# Altium project sig_gen_card.PrjPcb (part 3 of 4)
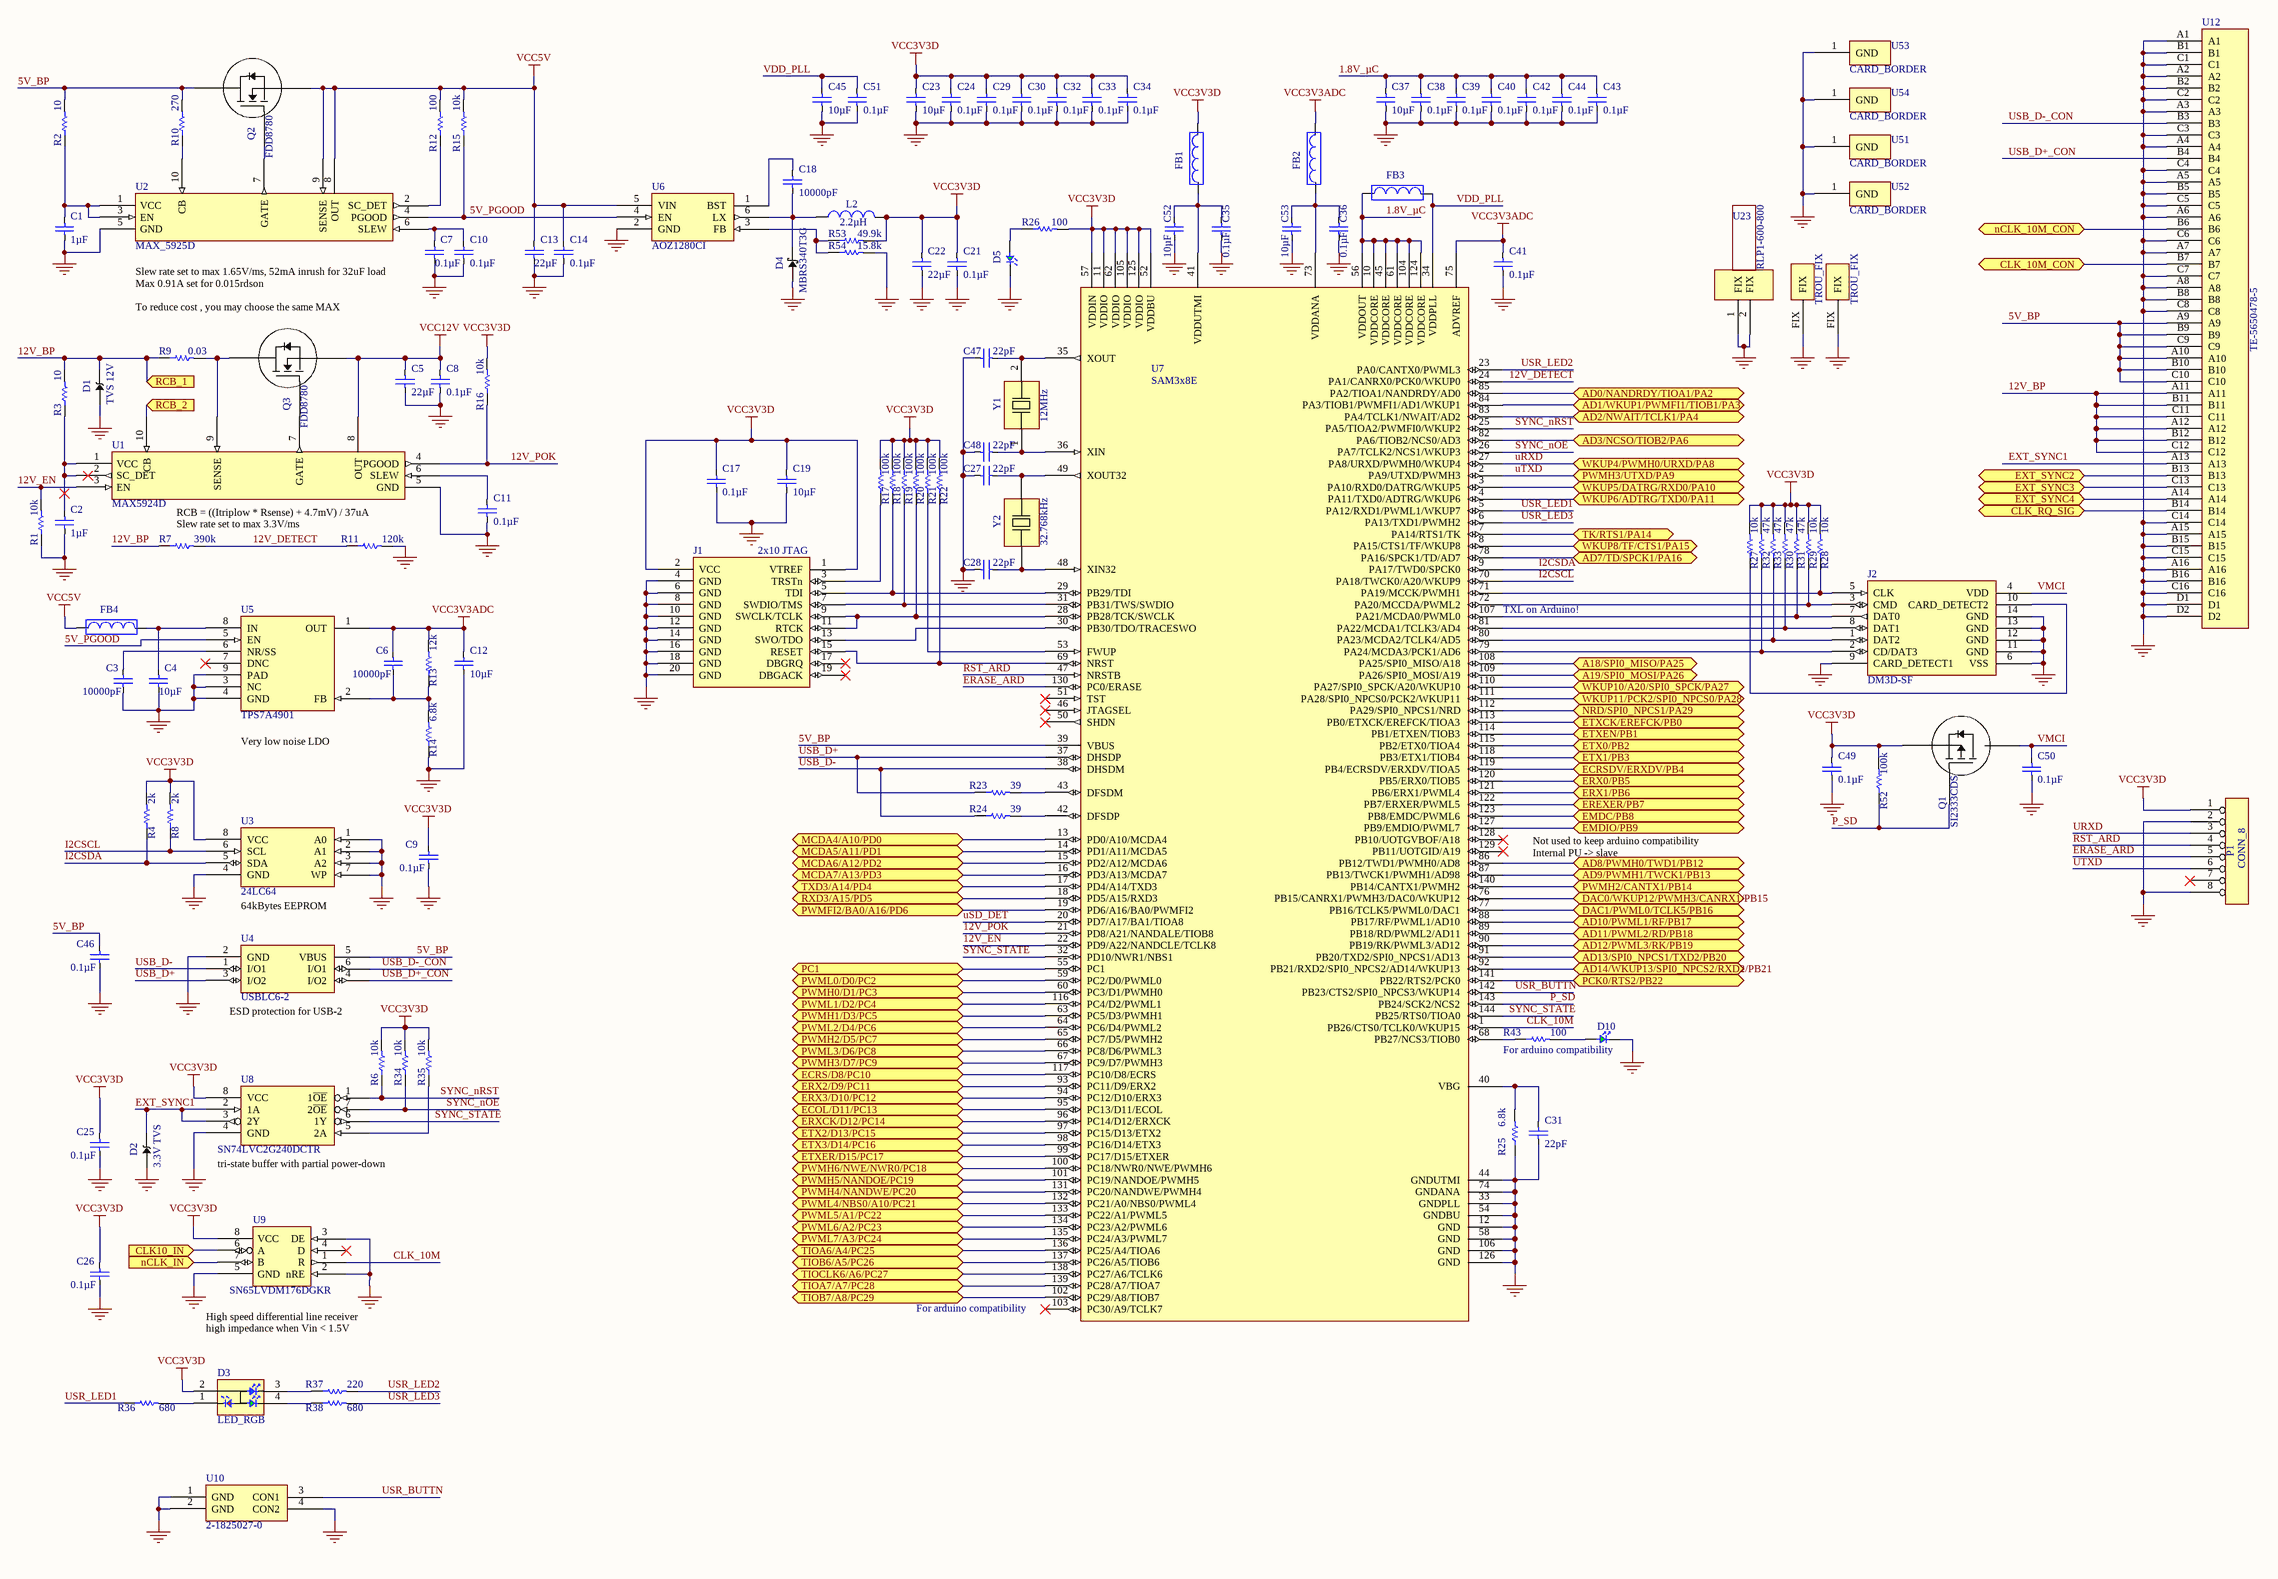
[diagram p6: EasyPHI_Core.SchDoc]

## Sheet EasyPHI_Core.SchDoc (continued)
### Library data of the parts
C1 C2 = EMK107B7105KA-T: CAP CER 1UF 16V X7R 0603; Manufacturer: Taiyo Yuden; Tolerance: ±10%; Design Item Id: EMK107B7105KA-T; Supplier 1: Digi-Key; Supplier Part Number 1: 587-1241-1-ND; Manufacturer Part Number: EMK107B7105KA-T; RoHS: RoHS Compliant; Category: Capacitors; Stock 1: 3073749; Pricing 1: 1=0.1, 10=0.06, 50=0.0326, 100=0.0275, 250=0.02252, 500=0.01926, 1000=0.015 (USD); Packaging: Cut Tape (CT); Applications: General Purpose; Operating Temperature: -55°C ~ 125°C; Mounting Type: Surface Mount, MLCC; Package / Case: 0603 (1608 Metric); ComponentLink1URL: http://ds.yuden.co.jp/TYCOMPAS/ut/detail.do?productNo=EMK107B7105KA-T&fileName=EMK107B7105KA-T_SS&mode=specSheetDownload; ComponentLink1Description: http://ds.yuden.co.jp/TYCOMPAS/ut/detail.do?productNo=EMK107B7105KA-T&fileName=EMK107B7105KA-T_SS&mode=specSheetDownload; Capacitance: 1µF; Voltage - Rated: 16V; Temperature Coefficient: X7R; Ratings: -; Size / Dimension: 0.063" L x 0.031" W (1.60mm x 0.80mm); Height - Seated (Max): -; Thickness (Max): 0.035" (0.90mm); Lead Spacing: -; Features: -; Lead Style: -
C3 C6 C18 = C0603C103K5RACTU: CAP CER 10000PF 50V X7R 0603; Manufacturer: Kemet; Tolerance: ±10%; Design Item Id: C0603C103K5RACTU; Supplier 1: Digi-Key; Supplier Part Number 1: 399-1091-1-ND; Manufacturer Part Number: C0603C103K5RACTU; RoHS: RoHS Compliant; Category: Capacitors; Stock 1: 1598674; Pricing 1: 1=0.1, 10=0.019, 50=0.0104, 100=0.0088, 250=0.0072, 500=0.00616, 1000=0.0048 (USD); Packaging: Cut Tape (CT); Applications: General Purpose; Operating Temperature: -55°C ~ 125°C; Mounting Type: Surface Mount, MLCC; Package / Case: 0603 (1608 Metric); ComponentLink1URL: http://www.kemet.com/docfinder?Partnumber=C0603C103K5RACTU; ComponentLink1Description: http://www.kemet.com/docfinder?Partnumber=C0603C103K5RACTU; Capacitance: 10000pF; Voltage - Rated: 50V; Temperature Coefficient: X7R; Ratings: -; Size / Dimension: 0.063" L x 0.031" W (1.60mm x 0.80mm); Height - Seated (Max): -; Thickness (Max): 0.034" (0.87mm); Lead Spacing: -; Features: -; Lead Style: -
C4 C12 C19 C23 C37 C45 C52 C53 = GRM188R60J106ME47J: CAP CER 10UF 6.3V 20% X5R 0603; Manufacturer: Murata Electronics North America; Design Item Id: GRM188R60J106ME47J; Supplier 1: Digi-Key; Supplier Part Number 1: 490-6405-1-ND; Manufacturer Part Number: GRM188R60J106ME47J; RoHS: RoHS Compliant; Category: Capacitors; Stock 1: 28946; Pricing 1: 1=0.19, 10=0.128, 50=0.0776, 100=0.0651, 250=0.05272, 500=0.0465, 1000=0.03953, 5000=0.03333 (USD); Packaging: Cut Tape (CT); Applications: General Purpose; Operating Temperature: -55°C ~ 85°C; Mounting Type: Surface Mount, MLCC; Package / Case: 0603 (1608 Metric); ComponentLink1URL: http://search.murata.co.jp/Ceramy/image/img/A01X/G101/ENG/GRM188R60J106ME47-01.pdf; ComponentLink1Description: http://search.murata.co.jp/Ceramy/image/img/A01X/G101/ENG/GRM188R60J106ME47-01.pdf; Capacitance: 10µF; Tolerance: ±20%; Voltage - Rated: 6.3V; Temperature Coefficient: X5R; Ratings: -; Size / Dimension: 0.063" L x 0.031" W (1.60mm x 0.80mm); Height - Seated (Max): -; Thickness (Max): 0.035" (0.90mm); Lead Spacing: -; Features: -; Lead Style: -
C5 C13 C22 = C2012X5R1C226K125AC: CAP CER 22UF 16V X5R 0805; Manufacturer: TDK Corporation; Tolerance: ±10%; Design Item Id: C2012X5R1C226K125AC; Supplier 1: Digi-Key; Supplier Part Number 1: 445-6797-1-ND; Manufacturer Part Number: C2012X5R1C226K125AC; RoHS: RoHS Compliant; Category: Capacitors; Stock 1: 448776; Pricing 1: 1=0.77, 10=0.737, 100=0.3575, 250=0.297, 500=0.2695, 1000=0.2475 (USD); Packaging: Cut Tape (CT); Applications: General Purpose; Operating Temperature: -55°C ~ 85°C; Mounting Type: Surface Mount, MLCC; Package / Case: 0805 (2012 Metric); ComponentLink1URL: https://product.tdk.com/info/en/catalog/datasheets/mlcc_commercial_general_en.pdf; ComponentLink1Description: https://product.tdk.com/info/en/catalog/datasheets/mlcc_commercial_general_en.pdf; Capacitance: 22µF; Voltage - Rated: 16V; Temperature Coefficient: X5R; Ratings: -; Size / Dimension: 0.079" L x 0.049" W (2.00mm x 1.25mm); Height - Seated (Max): -; Thickness (Max): 0.057" (1.45mm); Lead Spacing: -; Features: -; Lead Style: -
C7-C11 C14 C17 C21 C24-C26 C29 C30 C32-C36 C38-C44 C46 C49-C51 = GRM188R71C104KA01D: CAP CER 0.1UF 16V 10% X7R 0603; Manufacturer: Murata Electronics North America; Design Item Id: GRM188R71C104KA01D; Supplier 1: Digi-Key; Supplier Part Number 1: 490-1532-1-ND; Manufacturer Part Number: GRM188R71C104KA01D; RoHS: RoHS Compliant; Category: Capacitors; Stock 1: 2244997; Pricing 1: 1=0.1, 10=0.019, 50=0.0102, 100=0.0086, 250=0.00704, 500=0.006, 1000=0.00468 (USD); Packaging: Cut Tape (CT); Applications: General Purpose; Operating Temperature: -55°C ~ 125°C; Mounting Type: Surface Mount, MLCC; Package / Case: 0603 (1608 Metric); ComponentLink1URL: http://search.murata.co.jp/Ceramy/image/img/A01X/G101/ENG/GRM188R71C104KA01-01.pdf; ComponentLink1Description: http://search.murata.co.jp/Ceramy/image/img/A01X/G101/ENG/GRM188R71C104KA01-01.pdf; Capacitance: 0.1µF; Tolerance: ±10%; Voltage - Rated: 16V; Temperature Coefficient: X7R; Ratings: -; Size / Dimension: 0.063" L x 0.031" W (1.60mm x 0.80mm); Height - Seated (Max): -; Thickness (Max): 0.035" (0.90mm); Lead Spacing: -; Features: -; Lead Style: -
C27 C28 C31 C47 C48 = C1608C0G1H220J080AA: CAP CER 22PF 50V C0G 0603; Manufacturer: TDK Corporation; Tolerance: ±5%; Temperature Coefficient: C0G, NP0; Design Item Id: C1608C0G1H220J080AA; Supplier 1: Digi-Key; Supplier Part Number 1: 445-1273-1-ND; Manufacturer Part Number: C1608C0G1H220J080AA; RoHS: RoHS Compliant; Category: Capacitors; Stock 1: 716840; Pricing 1: 1=0.1, 10=0.03, 100=0.0138, 250=0.01124, 500=0.00962, 1000=0.0075 (USD); Packaging: Cut Tape (CT); Applications: General Purpose; Operating Temperature: -55°C ~ 125°C; Mounting Type: Surface Mount, MLCC; Package / Case: 0603 (1608 Metric); ComponentLink1URL: https://product.tdk.com/info/en/catalog/datasheets/mlcc_commercial_general_en.pdf; ComponentLink1Description: https://product.tdk.com/info/en/catalog/datasheets/mlcc_commercial_general_en.pdf; Capacitance: 22pF; Voltage - Rated: 50V; Ratings: -; Size / Dimension: 0.063" L x 0.031" W (1.60mm x 0.80mm); Height - Seated (Max): -; Thickness (Max): 0.037" (0.95mm); Lead Spacing: -; Features: -; Lead Style: -
D1 = SMAJ12A: TVS DIODE 12VWM 19.9VC SMA; Manufacturer: Littelfuse Inc.; Unidirectional Channels: 1; Voltage - Breakdown (Min): 13.3V; Voltage - Clamping (Max) @ Ipp: 19.9V; Current - Peak Pulse (10/1000µs): 20.1A; Power - Peak Pulse: 400W; Power Line Protection: No; Design Item Id: SMAJ12A; Supplier 1: Digi-Key; Supplier Part Number 1: SMAJ12ALFCT-ND; Manufacturer Part Number: SMAJ12A; RoHS: RoHS Compliant; Category: Circuit Protection; Stock 1: 15084; Pricing 1: 1=0.43, 10=0.36, 25=0.3156, 100=0.2701, 250=0.23424, 500=0.1984, 1000=0.15295, 2500=0.13984 (USD); Packaging: Cut Tape (CT); Type: Zener; Applications: General Purpose; Operating Temperature: -55°C ~ 150°C (TJ); Mounting Type: Surface Mount; Package / Case: DO-214AC, SMA; Supplier Device Package: DO-214AC (SMA); ComponentLink1URL: http://www.littelfuse.com/~/media/electronics/datasheets/tvs_diodes/littelfuse_tvs_diode_smaj_datasheet.pdf.pdf; ComponentLink1Description: http://www.littelfuse.com/~/media/electronics/datasheets/tvs_diodes/littelfuse_tvs_diode_smaj_datasheet.pdf.pdf; Bidirectional Channels: -; Voltage - Reverse Standoff (Typ): 12V; Capacitance @ Frequency: -
D2 = SMLVT3V3: TVS DIODE 3.3VWM 10.3VC SMB; Manufacturer: STMicroelectronics; Unidirectional Channels: 1; Voltage - Breakdown (Min): 4.1V; Voltage - Clamping (Max) @ Ipp: 10.3V; Current - Peak Pulse (10/1000µs): 200A (8/20µs); Power - Peak Pulse: 600W; Power Line Protection: No; Capacitance @ Frequency: 5200pF @ 1MHz; Design Item Id: SMLVT3V3; Supplier 1: Digi-Key; Supplier Part Number 1: 497-2496-1-ND; Manufacturer Part Number: SMLVT3V3; RoHS: RoHS Compliant; Category: Circuit Protection; Stock 1: 32800; Pricing 1: 1=0.65, 10=0.561, 100=0.4191, 500=0.32916, 1000=0.25375 (USD); Packaging: Cut Tape (CT); Type: Zener; Applications: General Purpose; Operating Temperature: -25°C ~ 175°C (TJ); Mounting Type: Surface Mount; Package / Case: DO-214AA, SMB; Supplier Device Package: SMB (DO-214AA); ComponentLink1URL: http://www.st.com/web/en/resource/technical/document/datasheet/CD00000923.pdf; ComponentLink1Description: http://www.st.com/web/en/resource/technical/document/datasheet/CD00000923.pdf; Bidirectional Channels: -; Voltage - Reverse Standoff (Typ): 3.3V
D3 = CLV1A-FKB-CJ1M1F1BB7R4S3: LED RGB DIFFUSED 4PLCC SMD; Manufacturer: Cree Inc.; Color: Red, Green, Blue (RGB); Lens Color: White; Millicandela Rating: 675mcd Red, 1055mcd Green, 337mcd Blue; Lens Style/Size: Round with Flat Top, 2.20mm; Voltage - Forward (Vf) (Typ): 2V Red, 3.2V Green, 3.2V Blue; Current - Test: 20mA Red, 20mA Green, 20mA Blue; Viewing Angle: 120°; Wavelength - Dominant: 621.5nm Red, 530nm Green, 470nm Blue; Wavelength - Peak: 630nm Red, 527nm Green, 470nm Blue; Design Item Id: CLV1A-FKB-CJ1M1F1BB7R4S3; Supplier 1: Digi-Key; Supplier Part Number 1: CLV1A-FKB-CJ1M1F1BB7R4S3CT-ND; Manufacturer Part Number: CLV1A-FKB-CJ1M1F1BB7R4S3; RoHS: RoHS Compliant; Category: Optoelectronics; Stock 1: 1787; Pricing 1: 1=0.6, 50=0.552, 100=0.529, 250=0.483, 500=0.437, 1000=0.391 (USD); Packaging: Cut Tape (CT); Mounting Type: Surface Mount; Package / Case: 4-PLCC; Supplier Device Package: 4-PLCC; ComponentLink1URL: http://media.digikey.com/pdf/Data%20Sheets/CREE%20Power/CLV1A-FKB_Rev5.pdf; ComponentLink1Description: http://media.digikey.com/pdf/Data%20Sheets/CREE%20Power/CLV1A-FKB_Rev5.pdf; Lens Transparency: Diffused; Features: *; Size / Dimension: 3.20mm L x 2.80mm W; Height (Max): 2.10mm
D4 = MBRS340T3G: DIODE SCHOTTKY 40V 4A SMC; Manufacturer: ON Semiconductor; Design Item Id: MBRS340T3G; Supplier 1: Digi-Key; Supplier Part Number 1: MBRS340T3GOSCT-ND; Manufacturer Part Number: MBRS340T3G; RoHS: RoHS Compliant; Category: Discrete Semiconductor Products; Stock 1: 7353; Pricing 1: 1=0.44, 10=0.378, 100=0.2826, 500=0.222, 1000=0.17115 (USD); Packaging: Cut Tape (CT)
D5 D10 = SML-D12M8WT86: LED GREEN DIFFUSED 0603 SMD; Manufacturer: Rohm Semiconductor; Lens Color: White; Millicandela Rating: 25mcd; Lens Style/Size: Rectangle with Flat Top, 1.20mm x 0.80mm; Voltage - Forward (Vf) (Typ): 2.2V; Current - Test: 20mA; Wavelength - Dominant: 572nm; Design Item Id: SML-D12M8WT86; Supplier 1: Digi-Key; Supplier Part Number 1: 511-1578-1-ND; Manufacturer Part Number: SML-D12M8WT86; RoHS: RoHS Compliant; Category: Optoelectronics; Stock 1: 55482; Pricing 1: 1=0.34, 10=0.264, 25=0.228, 100=0.144, 250=0.096, 500=0.0816, 1000=0.0624 (USD); Packaging: Cut Tape (CT); Mounting Type: Surface Mount; Package / Case: 0603 (1608 Metric); Supplier Device Package: 0603 (1608 Metric); ComponentLink1URL: http://rohmfs.rohm.com/en/products/databook/datasheet/opto/led/chip_mono/sml-d1.pdf; ComponentLink1Description: http://rohmfs.rohm.com/en/products/databook/datasheet/opto/led/chip_mono/sml-d1.pdf; Color: Green; Lens Transparency: Diffused; Viewing Angle: -; Wavelength - Peak: -; Features: -; Size / Dimension: 1.60mm L x 0.80mm W; Height (Max): 0.65mm
FB1-FB4 = BLM18KG601SN1D: FERRITE CHIP 600 OHM 1300MA 0603; Manufacturer: Murata Electronics North America; Filter Type: Power Line; Number of Lines: 1; Impedance @ Frequency: 600 Ohm @ 100MHz; Current Rating (Max): 1.3A; DC Resistance (DCR) (Max): 150 mOhm; Design Item Id: BLM18KG601SN1D; Supplier 1: Digi-Key; Supplier Part Number 1: 490-5258-1-ND; Manufacturer Part Number: BLM18KG601SN1D; RoHS: RoHS Compliant; Category: Filters; Stock 1: 487523; Pricing 1: 1=0.1, 10=0.087, 50=0.0712, 100=0.0523, 250=0.038, 500=0.03484, 1000=0.0301 (USD); Packaging: Cut Tape (CT); Operating Temperature: -55°C ~ 125°C; Mounting Type: Surface Mount; Package / Case: 0603 (1608 Metric); ComponentLink1URL: http://media.digikey.com/pdf/Data%20Sheets/Murata%20PDFs/BLM18yyyyyyN1x.pdf; ComponentLink1Description: http://media.digikey.com/pdf/Data%20Sheets/Murata%20PDFs/BLM18yyyyyyN1x.pdf; Size / Dimension: 0.063" L x 0.031" W (1.60mm x 0.80mm); Ratings: -; Height (Max): 0.037" (0.95mm)
J1 = SBH11-PBPC-D10-ST-BK: CONN HEADER 2.54MM 20POS GOLD; Manufacturer: Sullins Connector Solutions; Connector Type: Header, Shrouded; Number of Positions: 20; Number of Positions Loaded: All; Pitch: 0.100" (2.54mm); Design Item Id: SBH11-PBPC-D10-ST-BK; Supplier 1: Digi-Key; Supplier Part Number 1: S9172-ND; Manufacturer Part Number: SBH11-PBPC-D10-ST-BK; RoHS: RoHS Compliant; Category: Connectors, Interconnects; Stock 1: 10981; Pricing 1: 1=0.72, 10=0.558, 25=0.5196, 50=0.4726, 100=0.4253, 250=0.35912, 500=0.3402, 1000=0.3024, 2500=0.25137 (USD); Packaging: Tray; Mounting Type: Through Hole; ComponentLink1URL: http://media.digikey.com/pdf/Data%20Sheets/Sullins%20PDFs/SBH11-PBPC-Dxx-ST-xx.pdf; ComponentLink1Description: http://media.digikey.com/pdf/Data%20Sheets/Sullins%20PDFs/SBH11-PBPC-Dxx-ST-xx.pdf; Contact Type: Male Pin; Number of Rows: 2; Row Spacing: 0.100" (2.54mm); Contact Mating Length: -; Termination: Solder; Fastening Type: -; Features: Polarizing Key; Contact Finish: Gold; Contact Finish Thickness: Flash; Color: Black
J2 = DM3D-SF: CONN MICRO SD CARD PUSH-PULL; Manufacturer: Hirose Electric Co Ltd; Card Type: Secure Digital - microSD™; Number of Positions: 10 (8 + 2); Connector Type: Connector; Insertion, Removal Method: Push In, Pull Out; Design Item Id: DM3D-SF; Supplier 1: Digi-Key; Supplier Part Number 1: HR1941CT-ND; Manufacturer Part Number: DM3D-SF; RoHS: RoHS Compliant; Category: Connectors, Interconnects; Stock 1: 20570; Pricing 1: 1=1.88, 10=1.704, 25=1.6, 50=1.5304, 100=1.4608, 250=1.32172, 500=1.21738, 1000=1.023 (USD); Packaging: Cut Tape (CT); Mounting Type: Surface Mount, Right Angle; ComponentLink1URL: http://www.hirose.co.jp/cataloge_hp/e60900232.pdf; ComponentLink1Description: http://www.hirose.co.jp/cataloge_hp/e60900232.pdf; Features: Switch; Height Above Board: 0.061" (1.55mm); Ejector Side: -; Mounting Feature: Normal, Standard - Top; Contact Finish: Gold; Contact Finish Thickness: -
L2 = NR6028T2R2N: FIXED IND 2.2UH 3.7A 26 MOHM SMD; Manufacturer: Taiyo Yuden; Type: Wirewound; Material - Core: Ferrite; Tolerance: ±30%; Current - Saturation: 4.2A; Shielding: Shielded; DC Resistance (DCR): 26 mOhm Max; Frequency - Self Resonant: 68MHz; Frequency - Test: 100kHz; Design Item Id: NR6028T2R2N; Supplier 1: Digi-Key; Supplier Part Number 1: 587-2098-1-ND; Manufacturer Part Number: NR6028T2R2N; RoHS: RoHS Compliant; Category: Inductors, Coils, Chokes; Stock 1: 49188; Pricing 1: 1=0.35, 10=0.311, 25=0.276, 50=0.2416, 100=0.2243, 250=0.207, 500=0.19666, 1000=0.1587 (USD); Packaging: Cut Tape (CT); Operating Temperature: -25°C ~ 120°C; Mounting Type: Surface Mount; Package / Case: Nonstandard; ComponentLink1URL: http://ds.yuden.co.jp/TYCOMPAS/ut/detail.do?productNo=NR6028T2R2N&fileName=NR6028T2R2N_SS&mode=specSheetDownload; ComponentLink1Description: http://ds.yuden.co.jp/TYCOMPAS/ut/detail.do?productNo=NR6028T2R2N&fileName=NR6028T2R2N_SS&mode=specSheetDownload; Inductance: 2.2µH; Current Rating: 3.7A; Q @ Freq: -; Size / Dimension: 0.236" L x 0.236" W (6.00mm x 6.00mm); Height - Seated (Max): 0.110" (2.80mm); Ratings: -
P1 = 961108-5500-AR-PR: CONN HEADER R/A 8POS GOLD SMD; Manufacturer: 3M; Connector Type: Header, Unshrouded; Number of Positions: 8; Number of Positions Loaded: All; Pitch: 0.100" (2.54mm); Design Item Id: 961108-5500-AR-PR; Supplier 1: Digi-Key; Supplier Part Number 1: 3M9502CT-ND; Manufacturer Part Number: 961108-5500-AR-PR; RoHS: RoHS Compliant; Category: Connectors, Interconnects; Stock 1: 1064; Pricing 1: 1=2.23, 10=2.021, 25=1.8976, 50=1.815, 100=1.7325, 250=1.56752 (USD); Packaging: Cut Tape (CT); Mounting Type: Surface Mount, Right Angle; ComponentLink1URL: http://multimedia.3m.com/mws/mediawebserver?66666UuZjcFSLXTtNxTEmxfXEVuQEcuZgVs6EVs6E666666--; ComponentLink1Description: http://multimedia.3m.com/mws/mediawebserver?66666UuZjcFSLXTtNxTEmxfXEVuQEcuZgVs6EVs6E666666--; Contact Type: Male Pin; Number of Rows: 1; Row Spacing: -; Contact Mating Length: 0.230" (5.84mm); Termination: Solder; Fastening Type: -; Features: -; Contact Finish: Gold; Contact Finish Thickness: Flash; Color: Black
Q1 = SI2333CDS-T1-GE3: MOSFET P-CH 12V 7.1A SOT-23; Manufacturer: Vishay Siliconix; FET Type: MOSFET P-Channel, Metal Oxide; FET Feature: Standard; Current - Continuous Drain (Id) @ 25°C: 7.1A (Tc); Rds On (Max) @ Id, Vgs: 35 mOhm @ 5.1A, 4.5V; Vgs(th) (Max) @ Id: 1V @ 250µA; Gate Charge (Qg) @ Vgs: 25nC @ 4.5V; Input Capacitance (Ciss) @ Vds: 1225pF @ 6V; Power - Max: 2.5W; Design Item Id: SI2333CDS-T1-GE3; Supplier 1: Digi-Key; Supplier Part Number 1: SI2333CDS-T1-GE3CT-ND; Manufacturer Part Number: SI2333CDS-T1-GE3; RoHS: RoHS Compliant; Category: Discrete Semiconductor Products; Stock 1: 8222; Pricing 1: 1=0.43, 10=0.372, 100=0.2774, 500=0.21792, 1000=0.168 (USD); Packaging: Cut Tape (CT); Mounting Type: Surface Mount; Package / Case: TO-236-3, SC-59, SOT-23-3; Supplier Device Package: SOT-23-3 (TO-236); ComponentLink1URL: http://www.vishay.com/docs/68717/si2333cd.pdf; ComponentLink1Description: http://www.vishay.com/docs/68717/si2333cd.pdf; Drain to Source Voltage (Vdss): 12V
Q2 Q3 = FDD8780: MOSFET N-CH 25V 35A TO-252AA; Manufacturer: Fairchild Semiconductor; FET Type: MOSFET N-Channel, Metal Oxide; FET Feature: Standard; Current - Continuous Drain (Id) @ 25°C: 35A (Tc); Rds On (Max) @ Id, Vgs: 8.5 mOhm @ 35A, 10V; Vgs(th) (Max) @ Id: 2.5V @ 250µA; Gate Charge (Qg) @ Vgs: 29nC @ 10V; Input Capacitance (Ciss) @ Vds: 1440pF @ 13V; Power - Max: 50W; Design Item Id: FDD8780; Supplier 1: Digi-Key; Supplier Part Number 1: FDD8780CT-ND; Manufacturer Part Number: FDD8780; RoHS: RoHS Compliant; Category: Discrete Semiconductor Products; Stock 1: 53251; Pricing 1: 1=0.73, 10=0.643, 100=0.4914, 500=0.38934, 1000=0.31185 (USD); Packaging: Cut Tape (CT); Mounting Type: Surface Mount; Package / Case: TO-252-3, DPak (2 Leads + Tab), SC-63; Supplier Device Package: D-Pak; ComponentLink1URL: http://www.fairchildsemi.com/datasheets/FD/FDD8780.pdf; ComponentLink1Description: http://www.fairchildsemi.com/datasheets/FD/FDD8780.pdf; Drain to Source Voltage (Vdss): 25V
R1 R6 R15 R16 R34 R35 = ERJ-3EKF1002V: RES SMD 10K OHM 1% 1/10W 0603; Manufacturer: Panasonic Electronic Components; Power (Watts): 0.1W, 1/10W; Temperature Coefficient: ±100ppm/°C; Resistance: 10k; Design Item Id: ERJ-3EKF1002V; Footprint: RESC_1608[0603]_N; Supplier 1: Digi-Key; Supplier Part Number 1: P10.0KHCT-ND; Manufacturer Part Number: ERJ-3EKF1002V; RoHS: RoHS Compliant; Category: Resistors; Stock 1: 7323969; Pricing 1: 1=0.1, 50=0.0114, 100=0.0084, 250=0.00644, 500=0.00514, 1000=0.00379 (USD); Packaging: Cut Tape (CT); Operating Temperature: -55°C ~ 155°C; Package / Case: 0603 (1608 Metric); Supplier Device Package: 0603; ComponentLink1URL: http://industrial.panasonic.com/www-cgi/jvcr13pz.cgi?E+PZ+3+AOA0002+ERJ3EKF1002V+7+WW; ComponentLink1Description: http://industrial.panasonic.com/www-cgi/jvcr13pz.cgi?E+PZ+3+AOA0002+ERJ3EKF1002V+7+WW; Tolerance: ±1%; Composition: Thick Film; Features: Automotive AEC-Q200; Size / Dimension: 0.063" L x 0.031" W (1.60mm x 0.80mm); Height: 0.022" (0.55mm); Number of Terminations: 2
R2 R3 = RC0603FR-0710RL: RES SMD 10 OHM 1% 1/10W 0603; Manufacturer: Yageo; Power (Watts): 0.1W, 1/10W; Temperature Coefficient: ±200ppm/°C; Resistance: 10; Design Item Id: RC0603FR-0710RL; Footprint: RESC_1608[0603]_N; Supplier 1: Digi-Key; Supplier Part Number 1: 311-10.0HRCT-ND; Manufacturer Part Number: RC0603FR-0710RL; RoHS: RoHS Compliant; Category: Resistors; Stock 1: 1893020; Pricing 1: 1=0.1, 10=0.014, 25=0.01, 100=0.0057, 250=0.00436, 500=0.00348, 1000=0.00257, 2500=0.00223 (USD); Packaging: Cut Tape (CT); Operating Temperature: -55°C ~ 155°C; Package / Case: 0603 (1608 Metric); Supplier Device Package: 0603; ComponentLink1URL: http://www.yageo.com/NewPortal/yageodocoutput?fileName=/pdf/R-Chip/PYu-RC_Group_51_RoHS_L_3.pdf; ComponentLink1Description: http://www.yageo.com/NewPortal/yageodocoutput?fileName=/pdf/R-Chip/PYu-RC_Group_51_RoHS_L_3.pdf; Tolerance: ±1%; Composition: Thick Film; Features: Moisture Resistant; Size / Dimension: 0.063" L x 0.031" W (1.60mm x 0.80mm); Height: 0.022" (0.55mm); Number of Terminations: 2
R4 R8 = ERJ-3EKF2001V: RES SMD 2K OHM 1% 1/10W 0603; Manufacturer: Panasonic Electronic Components; Power (Watts): 0.1W, 1/10W; Temperature Coefficient: ±100ppm/°C; Resistance: 2k; Design Item Id: ERJ-3EKF2001V; Footprint: RESC_1608[0603]_N; Supplier 1: Digi-Key; Supplier Part Number 1: P2.00KHCT-ND; Manufacturer Part Number: ERJ-3EKF2001V; RoHS: RoHS Compliant; Category: Resistors; Stock 1: 1462315; Pricing 1: 1=0.1, 50=0.0114, 100=0.0084, 250=0.00644, 500=0.00514, 1000=0.00379 (USD); Packaging: Cut Tape (CT); Operating Temperature: -55°C ~ 155°C; Package / Case: 0603 (1608 Metric); Supplier Device Package: 0603; ComponentLink1URL: http://industrial.panasonic.com/www-cgi/jvcr13pz.cgi?E+PZ+3+AOA0002+ERJ3EKF2001V+7+WW; ComponentLink1Description: http://industrial.panasonic.com/www-cgi/jvcr13pz.cgi?E+PZ+3+AOA0002+ERJ3EKF2001V+7+WW; Tolerance: ±1%; Composition: Thick Film; Features: Automotive AEC-Q200; Size / Dimension: 0.063" L x 0.031" W (1.60mm x 0.80mm); Height: 0.022" (0.55mm); Number of Terminations: 2
R7 = RC0603FR-07390KL: RES SMD 390K OHM 1% 1/10W 0603; Manufacturer: Yageo; Power (Watts): 0.1W, 1/10W; Temperature Coefficient: ±100ppm/°C; Resistance: 390k; Design Item Id: RC0603FR-07390KL; Footprint: RESC_1608[0603]_N; Supplier 1: Digi-Key; Supplier Part Number 1: 311-390KHRCT-ND; Manufacturer Part Number: RC0603FR-07390KL; RoHS: RoHS Compliant; Category: Resistors; Stock 1: 109003; Pricing 1: 1=0.1, 10=0.014, 25=0.01, 100=0.0057, 250=0.00436, 500=0.00348, 1000=0.00257, 2500=0.00223 (USD); Packaging: Cut Tape (CT); Operating Temperature: -55°C ~ 155°C; Package / Case: 0603 (1608 Metric); Supplier Device Package: 0603; ComponentLink1URL: http://www.yageo.com/NewPortal/yageodocoutput?fileName=/pdf/R-Chip/PYu-RC_Group_51_RoHS_L_3.pdf; ComponentLink1Description: http://www.yageo.com/NewPortal/yageodocoutput?fileName=/pdf/R-Chip/PYu-RC_Group_51_RoHS_L_3.pdf; Tolerance: ±1%; Composition: Thick Film; Features: Moisture Resistant; Size / Dimension: 0.063" L x 0.031" W (1.60mm x 0.80mm); Height: 0.022" (0.55mm); Number of Terminations: 2
R9 = ERJ-6BWFR030V: RES SMD 0.03 OHM 1% 1/2W 0805; Manufacturer: Panasonic Electronic Components; Power (Watts): 0.5W, 1/2W; Temperature Coefficient: ±200ppm/°C; Resistance: 0.03; Design Item Id: ERJ-6BWFR030V; Supplier 1: Digi-Key; Supplier Part Number 1: P.03AQCT-ND; Manufacturer Part Number: ERJ-6BWFR030V; RoHS: RoHS Compliant; Category: Resistors; Stock 1: 75764; Pricing 1: 1=0.66, 50=0.3466, 100=0.2859, 250=0.24832, 500=0.20212, 1000=0.16031 (USD); Packaging: Cut Tape (CT); Operating Temperature: -55°C ~ 155°C; Package / Case: 0805 (2012 Metric); Supplier Device Package: 0805; ComponentLink1URL: http://industrial.panasonic.com/lecs/www-data/pdf/AOA0000/AOA0000CE3.pdf; ComponentLink1Description: http://industrial.panasonic.com/lecs/www-data/pdf/AOA0000/AOA0000CE3.pdf; Tolerance: ±1%; Composition: Thick Film; Features: Automotive AEC-Q200, Current Sense; Size / Dimension: 0.079" L x 0.049" W (2.00mm x 1.25mm); Height: 0.028" (0.70mm); Number of Terminations: 2
R10 = ERJ-3EKF2700V: RES SMD 270 OHM 1% 1/10W 0603; Manufacturer: Panasonic Electronic Components; Power (Watts): 0.1W, 1/10W; Temperature Coefficient: ±100ppm/°C; Resistance: 270; Design Item Id: ERJ-3EKF2700V; Footprint: RESC_1608[0603]_N; Supplier 1: Digi-Key; Supplier Part Number 1: P270HCT-ND; Manufacturer Part Number: ERJ-3EKF2700V; RoHS: RoHS Compliant; Category: Resistors; Stock 1: 254829; Pricing 1: 1=0.1, 50=0.0114, 100=0.0084, 250=0.00644, 500=0.00514, 1000=0.00379 (USD); Packaging: Cut Tape (CT); Operating Temperature: -55°C ~ 155°C; Package / Case: 0603 (1608 Metric); Supplier Device Package: 0603; ComponentLink1URL: http://industrial.panasonic.com/www-cgi/jvcr13pz.cgi?E+PZ+3+AOA0002+ERJ3EKF2700V+7+WW; ComponentLink1Description: http://industrial.panasonic.com/www-cgi/jvcr13pz.cgi?E+PZ+3+AOA0002+ERJ3EKF2700V+7+WW; Tolerance: ±1%; Composition: Thick Film; Features: Automotive AEC-Q200; Size / Dimension: 0.063" L x 0.031" W (1.60mm x 0.80mm); Height: 0.022" (0.55mm); Number of Terminations: 2
R11 = ERJ-3EKF1203V: RES SMD 120K OHM 1% 1/10W 0603; Manufacturer: Panasonic Electronic Components; Power (Watts): 0.1W, 1/10W; Temperature Coefficient: ±100ppm/°C; Resistance: 120k; Design Item Id: ERJ-3EKF1203V; Footprint: RESC_1608[0603]_N; Supplier 1: Digi-Key; Supplier Part Number 1: P120KHCT-ND; Manufacturer Part Number: ERJ-3EKF1203V; RoHS: RoHS Compliant; Category: Resistors; Stock 1: 136480; Pricing 1: 1=0.1, 50=0.0114, 100=0.0084, 250=0.00644, 500=0.00514, 1000=0.00379 (USD); Packaging: Cut Tape (CT); Operating Temperature: -55°C ~ 155°C; Package / Case: 0603 (1608 Metric); Supplier Device Package: 0603; ComponentLink1URL: http://industrial.panasonic.com/www-cgi/jvcr13pz.cgi?E+PZ+3+AOA0002+ERJ3EKF1203V+7+WW; ComponentLink1Description: http://industrial.panasonic.com/www-cgi/jvcr13pz.cgi?E+PZ+3+AOA0002+ERJ3EKF1203V+7+WW; Tolerance: ±1%; Composition: Thick Film; Features: Automotive AEC-Q200; Size / Dimension: 0.063" L x 0.031" W (1.60mm x 0.80mm); Height: 0.022" (0.55mm); Number of Terminations: 2
R12 R26 R43 = ERJ-3EKF1000V: RES SMD 100 OHM 1% 1/10W 0603; Manufacturer: Panasonic Electronic Components; Power (Watts): 0.1W, 1/10W; Temperature Coefficient: ±100ppm/°C; Resistance: 100; Design Item Id: ERJ-3EKF1000V; Footprint: RESC_1608[0603]_N; Supplier 1: Digi-Key; Supplier Part Number 1: P100HCT-ND; Manufacturer Part Number: ERJ-3EKF1000V; RoHS: RoHS Compliant; Category: Resistors; Stock 1: 2537661; Pricing 1: 1=0.1, 50=0.0114, 100=0.0084, 250=0.00644, 500=0.00514, 1000=0.00379 (USD); Packaging: Cut Tape (CT); Operating Temperature: -55°C ~ 155°C; Package / Case: 0603 (1608 Metric); Supplier Device Package: 0603; ComponentLink1URL: http://industrial.panasonic.com/www-cgi/jvcr13pz.cgi?E+PZ+3+AOA0002+ERJ3EKF1000V+7+WW; ComponentLink1Description: http://industrial.panasonic.com/www-cgi/jvcr13pz.cgi?E+PZ+3+AOA0002+ERJ3EKF1000V+7+WW; Tolerance: ±1%; Composition: Thick Film; Features: Automotive AEC-Q200; Size / Dimension: 0.063" L x 0.031" W (1.60mm x 0.80mm); Height: 0.022" (0.55mm); Number of Terminations: 2
R13 = ERJ-3EKF1202V: RES SMD 12K OHM 1% 1/10W 0603; Manufacturer: Panasonic Electronic Components; Power (Watts): 0.1W, 1/10W; Temperature Coefficient: ±100ppm/°C; Resistance: 12k; Design Item Id: ERJ-3EKF1202V; Footprint: RESC_1608[0603]_N; Supplier 1: Digi-Key; Supplier Part Number 1: P12.0KHCT-ND; Manufacturer Part Number: ERJ-3EKF1202V; RoHS: RoHS Compliant; Category: Resistors; Stock 1: 277730; Pricing 1: 1=0.1, 50=0.0114, 100=0.0084, 250=0.00644, 500=0.00514, 1000=0.00379 (USD); Packaging: Cut Tape (CT); Operating Temperature: -55°C ~ 155°C; Package / Case: 0603 (1608 Metric); Supplier Device Package: 0603; ComponentLink1URL: http://industrial.panasonic.com/www-cgi/jvcr13pz.cgi?E+PZ+3+AOA0002+ERJ3EKF1202V+7+WW; ComponentLink1Description: http://industrial.panasonic.com/www-cgi/jvcr13pz.cgi?E+PZ+3+AOA0002+ERJ3EKF1202V+7+WW; Tolerance: ±1%; Composition: Thick Film; Features: Automotive AEC-Q200; Size / Dimension: 0.063" L x 0.031" W (1.60mm x 0.80mm); Height: 0.022" (0.55mm); Number of Terminations: 2
R14 R25 = ERJ-3EKF6801V: RES SMD 6.8K OHM 1% 1/10W 0603; Manufacturer: Panasonic Electronic Components; Power (Watts): 0.1W, 1/10W; Temperature Coefficient: ±100ppm/°C; Resistance: 6.8k; Design Item Id: ERJ-3EKF6801V; Footprint: RESC_1608[0603]_N; Supplier 1: Digi-Key; Supplier Part Number 1: P6.80KHCT-ND; Manufacturer Part Number: ERJ-3EKF6801V; RoHS: RoHS Compliant; Category: Resistors; Stock 1: 376087; Pricing 1: 1=0.1, 50=0.0114, 100=0.0084, 250=0.00644, 500=0.00514, 1000=0.00379 (USD); Packaging: Cut Tape (CT); Operating Temperature: -55°C ~ 155°C; Package / Case: 0603 (1608 Metric); Supplier Device Package: 0603; ComponentLink1URL: http://industrial.panasonic.com/www-cgi/jvcr13pz.cgi?E+PZ+3+AOA0002+ERJ3EKF6801V+7+WW; ComponentLink1Description: http://industrial.panasonic.com/www-cgi/jvcr13pz.cgi?E+PZ+3+AOA0002+ERJ3EKF6801V+7+WW; Tolerance: ±1%; Composition: Thick Film; Features: Automotive AEC-Q200; Size / Dimension: 0.063" L x 0.031" W (1.60mm x 0.80mm); Height: 0.022" (0.55mm); Number of Terminations: 2
R17-R22 R52 = ERJ-3EKF1003V: RES SMD 100K OHM 1% 1/10W 0603; Manufacturer: Panasonic Electronic Components; Power (Watts): 0.1W, 1/10W; Temperature Coefficient: ±100ppm/°C; Resistance: 100k; Design Item Id: ERJ-3EKF1003V; Footprint: RESC_1608[0603]_N; Supplier 1: Digi-Key; Supplier Part Number 1: P100KHCT-ND; Manufacturer Part Number: ERJ-3EKF1003V; RoHS: RoHS Compliant; Category: Resistors; Stock 1: 4343694; Pricing 1: 1=0.1, 50=0.0114, 100=0.0084, 250=0.00644, 500=0.00514, 1000=0.00379 (USD); Packaging: Cut Tape (CT); Operating Temperature: -55°C ~ 155°C; Package / Case: 0603 (1608 Metric); Supplier Device Package: 0603; ComponentLink1URL: http://industrial.panasonic.com/www-cgi/jvcr13pz.cgi?E+PZ+3+AOA0002+ERJ3EKF1003V+7+WW; ComponentLink1Description: http://industrial.panasonic.com/www-cgi/jvcr13pz.cgi?E+PZ+3+AOA0002+ERJ3EKF1003V+7+WW; Tolerance: ±1%; Composition: Thick Film; Features: Automotive AEC-Q200; Size / Dimension: 0.063" L x 0.031" W (1.60mm x 0.80mm); Height: 0.022" (0.55mm); Number of Terminations: 2
R23 R24 = RC0603JR-0739RL: RES SMD 39 OHM 5% 1/10W 0603; Manufacturer: Yageo; Power (Watts): 0.1W, 1/10W; Temperature Coefficient: ±100ppm/°C; Resistance: 39; Design Item Id: RC0603JR-0739RL; Footprint: RESC_1608[0603]_N; Supplier 1: Digi-Key; Supplier Part Number 1: 311-39GRCT-ND; Manufacturer Part Number: RC0603JR-0739RL; RoHS: RoHS Compliant; Category: Resistors; Stock 1: 69595; Pricing 1: 1=0.1, 10=0.011, 25=0.008, 100=0.0044, 250=0.00336, 500=0.0027, 1000=0.00198, 2500=0.00172 (USD); Packaging: Cut Tape (CT); Operating Temperature: -55°C ~ 155°C; Package / Case: 0603 (1608 Metric); Supplier Device Package: 0603; ComponentLink1URL: http://www.yageo.com/NewPortal/yageodocoutput?fileName=/pdf/R-Chip/PYu-RC_Group_51_RoHS_L_3.pdf; ComponentLink1Description: http://www.yageo.com/NewPortal/yageodocoutput?fileName=/pdf/R-Chip/PYu-RC_Group_51_RoHS_L_3.pdf; Tolerance: ±5%; Composition: Thick Film; Features: Moisture Resistant; Size / Dimension: 0.063" L x 0.031" W (1.60mm x 0.80mm); Height: 0.022" (0.55mm); Number of Terminations: 2
R27-R29 = ERJ-3GEYJ103V: RES 10K OHM 1/10W 5% 0603 SMD; Manufacturer: Panasonic Electronic Components; Power (Watts): 0.1W, 1/10W; Temperature Coefficient: ±200ppm/°C; Resistance: 10k; Design Item Id: ERJ-3GEYJ103V; Footprint: RESC_1608[0603]_N; Supplier 1: Digi-Key; Supplier Part Number 1: P10KGCT-ND; Manufacturer Part Number: ERJ-3GEYJ103V; RoHS: RoHS Compliant; Category: Resistors; Stock 1: 3519552; Pricing 1: 1=0.1, 50=0.0126, 100=0.0096, 250=0.00716, 500=0.00528, 1000=0.00352, 2500=0.00297 (USD); Packaging: Cut Tape (CT); Operating Temperature: -55°C ~ 155°C; Package / Case: 0603 (1608 Metric); Supplier Device Package: 0603; ComponentLink1URL: http://industrial.panasonic.com/www-cgi/jvcr13pz.cgi?E+PZ+3+AOA0001+ERJ3GEYJ103V+7+WW; ComponentLink1Description: http://industrial.panasonic.com/www-cgi/jvcr13pz.cgi?E+PZ+3+AOA0001+ERJ3GEYJ103V+7+WW; Tolerance: ±5%; Composition: Thick Film; Features: Automotive AEC-Q200 Qualified; Size / Dimension: 0.063" L x 0.031" W (1.60mm x 0.80mm); Height: 0.022" (0.55mm); Number of Terminations: 2
R30-R33 = ERJ-3EKF4702V: RES SMD 47K OHM 1% 1/10W 0603; Manufacturer: Panasonic Electronic Components; Power (Watts): 0.1W, 1/10W; Temperature Coefficient: ±100ppm/°C; Resistance: 47k; Design Item Id: ERJ-3EKF4702V; Footprint: RESC_1608[0603]_N; Supplier 1: Digi-Key; Supplier Part Number 1: P47.0KHCT-ND; Manufacturer Part Number: ERJ-3EKF4702V; RoHS: RoHS Compliant; Category: Resistors; Stock 1: 5099920; Pricing 1: 1=0.1, 50=0.0114, 100=0.0084, 250=0.00644, 500=0.00514, 1000=0.00379 (USD); Packaging: Cut Tape (CT); Operating Temperature: -55°C ~ 155°C; Package / Case: 0603 (1608 Metric); Supplier Device Package: 0603; ComponentLink1URL: http://industrial.panasonic.com/www-cgi/jvcr13pz.cgi?E+PZ+3+AOA0002+ERJ3EKF4702V+7+WW; ComponentLink1Description: http://industrial.panasonic.com/www-cgi/jvcr13pz.cgi?E+PZ+3+AOA0002+ERJ3EKF4702V+7+WW; Tolerance: ±1%; Composition: Thick Film; Features: Automotive AEC-Q200; Size / Dimension: 0.063" L x 0.031" W (1.60mm x 0.80mm); Height: 0.022" (0.55mm); Number of Terminations: 2
R36 R38 = RC0603FR-07680RL: RES SMD 680 OHM 1% 1/10W 0603; Manufacturer: Yageo; Power (Watts): 0.1W, 1/10W; Temperature Coefficient: ±100ppm/°C; Resistance: 680; Design Item Id: RC0603FR-07680RL; Footprint: RESC_1608[0603]_N; Supplier 1: Digi-Key; Supplier Part Number 1: 311-680HRCT-ND; Manufacturer Part Number: RC0603FR-07680RL; RoHS: RoHS Compliant; Category: Resistors; Stock 1: 574560; Pricing 1: 1=0.1, 10=0.014, 25=0.01, 100=0.0057, 250=0.00436, 500=0.00348, 1000=0.00257, 2500=0.00223 (USD); Packaging: Cut Tape (CT); Operating Temperature: -55°C ~ 155°C; Package / Case: 0603 (1608 Metric); Supplier Device Package: 0603; ComponentLink1URL: http://www.yageo.com/NewPortal/yageodocoutput?fileName=/pdf/R-Chip/PYu-RC_Group_51_RoHS_L_3.pdf; ComponentLink1Description: http://www.yageo.com/NewPortal/yageodocoutput?fileName=/pdf/R-Chip/PYu-RC_Group_51_RoHS_L_3.pdf; Tolerance: ±1%; Composition: Thick Film; Features: Moisture Resistant; Size / Dimension: 0.063" L x 0.031" W (1.60mm x 0.80mm); Height: 0.022" (0.55mm); Number of Terminations: 2
R37 = RC0603FR-07220RL: RES SMD 220 OHM 1% 1/10W 0603; Manufacturer: Yageo; Power (Watts): 0.1W, 1/10W; Temperature Coefficient: ±100ppm/°C; Resistance: 220; Design Item Id: RC0603FR-07220RL; Footprint: RESC_1608[0603]_N; Supplier 1: Digi-Key; Supplier Part Number 1: 311-220HRCT-ND; Manufacturer Part Number: RC0603FR-07220RL; RoHS: RoHS Compliant; Category: Resistors; Stock 1: 154701; Pricing 1: 1=0.1, 10=0.014, 25=0.01, 100=0.0057, 250=0.00436, 500=0.00348, 1000=0.00257, 2500=0.00223 (USD); Packaging: Cut Tape (CT); Operating Temperature: -55°C ~ 155°C; Package / Case: 0603 (1608 Metric); Supplier Device Package: 0603; ComponentLink1URL: http://www.yageo.com/NewPortal/yageodocoutput?fileName=/pdf/R-Chip/PYu-RC_Group_51_RoHS_L_3.pdf; ComponentLink1Description: http://www.yageo.com/NewPortal/yageodocoutput?fileName=/pdf/R-Chip/PYu-RC_Group_51_RoHS_L_3.pdf; Tolerance: ±1%; Composition: Thick Film; Features: Moisture Resistant; Size / Dimension: 0.063" L x 0.031" W (1.60mm x 0.80mm); Height: 0.022" (0.55mm); Number of Terminations: 2
R53 = RC0603FR-0749K9L: RES SMD 49.9K OHM 1% 1/10W 0603; Manufacturer: Yageo; Power (Watts): 0.1W, 1/10W; Temperature Coefficient: ±100ppm/°C; Resistance: 49.9k; Design Item Id: RC0603FR-0749K9L; Footprint: RESC_1608[0603]_N; Supplier 1: Digi-Key; Supplier Part Number 1: 311-49.9KHRCT-ND; Manufacturer Part Number: RC0603FR-0749K9L; RoHS: RoHS Compliant; Category: Resistors; Stock 1: 513376; Pricing 1: 1=0.1, 10=0.014, 25=0.01, 100=0.0057, 250=0.00436, 500=0.00348, 1000=0.00257, 2500=0.00223 (USD); Packaging: Cut Tape (CT); Operating Temperature: -55°C ~ 155°C; Package / Case: 0603 (1608 Metric); Supplier Device Package: 0603; ComponentLink1URL: http://www.yageo.com/NewPortal/yageodocoutput?fileName=/pdf/R-Chip/PYu-RC_Group_51_RoHS_L_3.pdf; ComponentLink1Description: http://www.yageo.com/NewPortal/yageodocoutput?fileName=/pdf/R-Chip/PYu-RC_Group_51_RoHS_L_3.pdf; Tolerance: ±1%; Composition: Thick Film; Features: Moisture Resistant; Size / Dimension: 0.063" L x 0.031" W (1.60mm x 0.80mm); Height: 0.022" (0.55mm); Number of Terminations: 2
R54 = RC0603FR-0715K8L: RES SMD 15.8K OHM 1% 1/10W 0603; Manufacturer: Yageo; Power (Watts): 0.1W, 1/10W; Temperature Coefficient: ±100ppm/°C; Resistance: 15.8k; Design Item Id: RC0603FR-0715K8L; Footprint: RESC_1608[0603]_N; Supplier 1: Digi-Key; Supplier Part Number 1: 311-15.8KHRCT-ND; Manufacturer Part Number: RC0603FR-0715K8L; RoHS: RoHS Compliant; Category: Resistors; Stock 1: 7150; Pricing 1: 1=0.1, 10=0.014, 25=0.01, 100=0.0057, 250=0.00436, 500=0.00348, 1000=0.00257, 2500=0.00223 (USD); Packaging: Cut Tape (CT); Operating Temperature: -55°C ~ 155°C; Package / Case: 0603 (1608 Metric); Supplier Device Package: 0603; ComponentLink1URL: http://www.yageo.com/NewPortal/yageodocoutput?fileName=/pdf/R-Chip/PYu-RC_Group_51_RoHS_L_3.pdf; ComponentLink1Description: http://www.yageo.com/NewPortal/yageodocoutput?fileName=/pdf/R-Chip/PYu-RC_Group_51_RoHS_L_3.pdf; Tolerance: ±1%; Composition: Thick Film; Features: Moisture Resistant; Size / Dimension: 0.063" L x 0.031" W (1.60mm x 0.80mm); Height: 0.022" (0.55mm); Number of Terminations: 2
U1 = MAX5924DEUB+: IC HOT-SWAP CTRLR N-CH 10-UMAX; Manufacturer: Maxim Integrated; Number of Channels: 1; Internal Switch(s): No; Programmable Features: Circuit Breaker, Slew Rate, Turn On Voltage; Voltage - Supply: 1 V ~ 13.2 V; Current - Supply: 1.5mA; Feature Pins: CB, EN, PGOOD, SC_DET, SLEW; Design Item Id: MAX5924DEUB+; Supplier 1: Digi-Key; Supplier Part Number 1: MAX5924DEUB+-ND; Manufacturer Part Number: MAX5924DEUB+; RoHS: RoHS Compliant; Category: Integrated Circuits (ICs); Stock 1: 69; Pricing 1: 1=4.89, 10=4.645, 25=3.38, 50=3.211, 100=2.26, 250=2.23124 (USD); Packaging: Tube; Type: Hot Swap Controller; Applications: General Purpose; Features: Auto Retry, Fault Timeout, UVLO; Current - Output (Max): -; Operating Temperature: -40°C ~ 85°C; Mounting Type: Surface Mount; Package / Case: 10-TFSOP, 10-MSOP (0.118", 3.00mm Width); Supplier Device Package: 10-uMAX; ComponentLink1URL: http://datasheets.maximintegrated.com/en/ds/MAX5924-MAX5926.pdf; ComponentLink1Description: http://datasheets.maximintegrated.com/en/ds/MAX5924-MAX5926.pdf
U2 = MAX5925DEUB+: IC HOT-SWAP CTRLR N-CH 10-UMAX; Manufacturer: Maxim Integrated; Number of Channels: 1; Internal Switch(s): No; Programmable Features: Circuit Breaker, Slew Rate, Turn On Voltage; Voltage - Supply: 1 V ~ 13.2 V; Current - Supply: 1.5mA; Feature Pins: CB, EN, PGOOD, SC_DET, SLEW; Design Item Id: MAX5925DEUB+; Supplier 1: Digi-Key; Supplier Part Number 1: MAX5925DEUB+-ND; Manufacturer Part Number: MAX5925DEUB+; RoHS: RoHS Compliant; Category: Integrated Circuits (ICs); Stock 1: 50; Pricing 1: 1=7.97, 10=7.572, 25=5.52, 50=5.244, 100=3.68, 250=3.64652 (USD); Packaging: Tube; Type: Hot Swap Controller; Applications: General Purpose; Features: Auto Retry, Fault Timeout, UVLO; Current - Output (Max): -; Operating Temperature: -40°C ~ 85°C; Mounting Type: Surface Mount; Package / Case: 10-TFSOP, 10-MSOP (0.118", 3.00mm Width); Supplier Device Package: 10-uMAX; ComponentLink1URL: http://datasheets.maximintegrated.com/en/ds/MAX5924-MAX5926.pdf; ComponentLink1Description: http://datasheets.maximintegrated.com/en/ds/MAX5924-MAX5926.pdf
U3 = 24LC64-I/SN: IC EEPROM 64KBIT 400KHZ 8SOIC; Manufacturer: Microchip Technology; Voltage - Supply: 2.5 V ~ 5.5 V; Format - Memory: EEPROMs - Serial; Memory Size: 64K (8K x 8); Interface: I²C, 2-Wire Serial; Design Item Id: 24LC64-I/SN; Supplier 1: Digi-Key; Supplier Part Number 1: 24LC64-I/SN-ND; Manufacturer Part Number: 24LC64-I/SN; RoHS: RoHS Compliant; Category: Integrated Circuits (ICs); Stock 1: 20397; Pricing 1: 1=0.47, 10=0.388, 25=0.3776, 100=0.357 (USD); Packaging: Tube; Operating Temperature: -40°C ~ 85°C; Package / Case: 8-SOIC (0.154", 3.90mm Width); Supplier Device Package: 8-SOIC N; ComponentLink1URL: http://www.microchip.com/mymicrochip/filehandler.aspx?ddocname=en011843; ComponentLink1Description: http://www.microchip.com/mymicrochip/filehandler.aspx?ddocname=en011843; Memory Type: EEPROM; Speed: 400kHz
U4 = USBLC6-2SC6: TVS DIODE 5.25VWM 17VC SOT23-6; Manufacturer: STMicroelectronics; Bidirectional Channels: 2; Voltage - Reverse Standoff (Typ): 5.25V; Voltage - Breakdown (Min): 6V; Voltage - Clamping (Max) @ Ipp: 17V; Current - Peak Pulse (10/1000µs): 5A (8/20µs); Power Line Protection: Yes; Design Item Id: USBLC6-2SC6; Supplier 1: Digi-Key; Supplier Part Number 1: 497-5235-1-ND; Manufacturer Part Number: USBLC6-2SC6; RoHS: RoHS Compliant; Category: Circuit Protection; Stock 1: 21922; Pricing 1: 1=0.51, 10=0.411, 100=0.2805, 500=0.20996, 1000=0.15725 (USD); Packaging: Cut Tape (CT); Type: Steering (Rail to Rail); Applications: Ethernet; Operating Temperature: -40°C ~ 125°C (TJ); Mounting Type: Surface Mount; Package / Case: SOT-23-6; Supplier Device Package: SOT-23-6; ComponentLink1URL: http://www.st.com/web/en/resource/technical/document/datasheet/CD00050750.pdf; ComponentLink1Description: http://www.st.com/web/en/resource/technical/document/datasheet/CD00050750.pdf; Unidirectional Channels: -; Power - Peak Pulse: -; Capacitance @ Frequency: -
U5 = TPS7A4901DGNT: IC REG LDO ADJ 0.15A 8MSOP; Manufacturer: Texas Instruments; Voltage - Output: 1.194 V ~ 33 V; Voltage - Input: 3 V ~ 35 V; Current - Output: 150mA; Regulator Topology: Positive Adjustable; Voltage - Dropout (Typical): 0.333V @ 150mA; Number of Regulators: 1; Current - Limit (Min): 220mA; Design Item Id: TPS7A4901DGNT; Supplier 1: Digi-Key; Supplier Part Number 1: 296-27769-1-ND; Manufacturer Part Number: TPS7A4901DGNT; RoHS: RoHS Compliant; Category: Integrated Circuits (ICs); Stock 1: 2542; Pricing 1: 1=3.37, 10=3.019, 25=2.7144, 100=2.4687 (USD); Packaging: Cut Tape (CT); Operating Temperature: -40°C ~ 125°C; Mounting Type: Surface Mount; Package / Case: 8-TSSOP, 8-MSOP (0.118", 3.00mm Width) Exposed Pad; Supplier Device Package: 8-MSOP-PowerPad; ComponentLink1URL: http://www.ti.com/lit/ds/symlink/tps7a4901.pdf; ComponentLink1Description: http://www.ti.com/lit/ds/symlink/tps7a4901.pdf
U6 = AOZ1280CI: IC REG BUCK ADJ 1.2A SOT23-6; Manufacturer: Alpha & Omega Semiconductor Inc; Output Type: Adjustable; Number of Outputs: 1; Voltage - Output: 0.8 V ~ 26 V; Voltage - Input: 3 V ~ 26 V; Frequency - Switching: 1.5MHz; Synchronous Rectifier: No; Design Item Id: AOZ1280CI; Supplier 1: Digi-Key; Supplier Part Number 1: 785-1277-1-ND; Manufacturer Part Number: AOZ1280CI; RoHS: RoHS Compliant; Category: Integrated Circuits (ICs); Stock 1: 81120; Pricing 1: 1=0.7, 25=0.5424, 100=0.4726, 250=0.4114, 500=0.3502, 1000=0.2805 (USD); Packaging: Cut Tape (CT); Type: Step-Down (Buck); Operating Temperature: -40°C ~ 85°C; Mounting Type: Surface Mount; Package / Case: SOT-23-6; Supplier Device Package: SOT-23-6; ComponentLink1URL: http://aosmd.com/res/data_sheets/AOZ1280CI.pdf; ComponentLink1Description: http://aosmd.com/res/data_sheets/AOZ1280CI.pdf; Current - Output: 1.2A
U7 = ATSAM3X8EA-AU: IC MCU 32BIT 512KB FLASH 144LQFP; Manufacturer: Atmel; Core Processor: ARM® Cortex®-M3; Core Size: 32-Bit; Speed: 84MHz; Connectivity: CAN, EBI/EMI, Ethernet, I²C, IrDA, LIN, Memory Card, SPI, SSC, UART/USART, USB; Peripherals: Brown-out Detect/Reset, DMA, I²S, POR, PWM, WDT; Number of I/O: 103; Program Memory Size: 512KB (512K x 8); RAM Size: 100K x 8; Voltage - Supply (Vcc/Vdd): 1.62 V ~ 1.95 V; Data Converters: A/D 16x12b, D/A 2x12b; Oscillator Type: Internal; Design Item Id: ATSAM3X8EA-AU; Supplier 1: Digi-Key; Supplier Part Number 1: ATSAM3X8EA-AU-ND; Manufacturer Part Number: ATSAM3X8EA-AU; RoHS: RoHS Compliant; Category: Integrated Circuits (ICs); Stock 1: 0; Pricing 1: 1=12.28, 10=11.163, 50=10.3254, 100=9.4881, 250=8.65096, 500=8.09282, 1000=7.75175 (USD); Packaging: Tray; Operating Temperature: -40°C ~ 85°C; Package / Case: 144-LQFP; Supplier Device Package: 144-LQFP (20x20); ComponentLink1URL: http://www.atmel.com/Images/doc11057s.pdf; ComponentLink1Description: http://www.atmel.com/Images/doc11057s.pdf; Program Memory Type: FLASH; EEPROM Size: -
U8 = SN74LVC2G240DCTR: IC INVERTER DUAL 1-INPUT SM8; Manufacturer: Texas Instruments; Voltage - Supply: 1.65 V ~ 5.5 V; Logic Type: Buffer/Line Driver, Inverting; Number of Elements: 2; Number of Bits per Element: 1; Current - Output High, Low: 32mA, 32mA; Design Item Id: SN74LVC2G240DCTR; Supplier 1: Digi-Key; Supplier Part Number 1: 296-15588-1-ND; Manufacturer Part Number: SN74LVC2G240DCTR; RoHS: RoHS Compliant; Category: Integrated Circuits (ICs); Stock 1: 10727; Pricing 1: 1=0.64, 10=0.536, 25=0.4692, 100=0.4017, 250=0.3484, 500=0.2951, 750=0.2548, 1000=0.2275 (USD); Packaging: Cut Tape (CT); Operating Temperature: -40°C ~ 125°C; Mounting Type: Surface Mount; Package / Case: 8-LSSOP (0.11", 2.80mm Width); Supplier Device Package: SM8; ComponentLink1URL: http://www.ti.com/lit/ds/symlink/sn74lvc2g240.pdf; ComponentLink1Description: http://www.ti.com/lit/ds/symlink/sn74lvc2g240.pdf
U9 = SN65LVDM176DGKR: IC DIFF LINE TXRX H-S 8VSSOP; Manufacturer: Texas Instruments; Voltage - Supply: 3 V ~ 3.6 V; Protocol: LVDS; Number of Drivers/Receivers: 1/1; Duplex: Half; Data Rate: 400Mbps; Design Item Id: SN65LVDM176DGKR; Supplier 1: Digi-Key; Supplier Part Number 1: 296-41394-1-ND; Manufacturer Part Number: SN65LVDM176DGKR; RoHS: RoHS Compliant; Category: Integrated Circuits (ICs); Stock 1: 4253; Pricing 1: 1=4.18, 10=3.749, 100=3.0753, 500=2.6163, 1000=2.2032 (USD); Packaging: Cut Tape (CT); Type: Transceiver; Operating Temperature: -40°C ~ 85°C; Mounting Type: Surface Mount; Package / Case: 8-TSSOP, 8-MSOP (0.118", 3.00mm Width); Supplier Device Package: 8-VSSOP; ComponentLink1URL: http://www.ti.com/lit/ds/symlink/sn65lvdm176.pdf; ComponentLink1Description: http://www.ti.com/lit/ds/symlink/sn65lvdm176.pdf; Receiver Hysteresis: -
U10 = 2-1825027-0: SWITCH TACTILE SPST-NO 0.05A 24V; Manufacturer: TE Connectivity Alcoswitch Switches; Switch Function: Off-Mom; Contact Rating @ Voltage: 0.05A @ 24VDC; Actuator Type: Standard; Actuator Height off PCB, from Pins: 11.85mm; Actuator Orientation: Side Actuated; Outline: 7.10mm x 7.00mm; Illumination: Non-Illuminated; Operating Force: 160gf; Actuator Material: Polyamide (PA), Nylon; Switch Travel: 0.25mm; Mechanical Life: 100,000 Cycles; Design Item Id: 2-1825027-0; Supplier 1: Digi-Key; Supplier Part Number 1: 450-1661-ND; Manufacturer Part Number: 2-1825027-0; RoHS: RoHS Compliant; Category: Switches; Stock 1: 8145; Pricing 1: 1=0.14, 10=0.131, 25=0.1212, 50=0.111, 100=0.102, 200=0.096, 500=0.091, 1000=0.087 (USD); Packaging: Bulk; Features: -; Operating Temperature: -35°C ~ 85°C; Mounting Type: Through Hole, Right Angle; ComponentLink1URL: http://www.te.com/commerce/DocumentDelivery/DDEController?Action=srchrtrv&DocNm=1825027&DocType=Customer+Drawing&DocLang=English; ComponentLink1Description: http://www.te.com/commerce/DocumentDelivery/DDEController?Action=srchrtrv&DocNm=1825027&DocType=Customer+Drawing&DocLang=English; Circuit: SPST-NO; Termination Style: PC Pin; Illumination Voltage (Nominal): -; Illumination Type, Color: -; Ingress Protection: -
U12 = 5650478-5: CONN DIN PLUG 48POS RT ANG PCB; Manufacturer: TE Connectivity AMP Connectors; Connector Type: Plug, Male Pins; Number of Positions: 48; Number of Positions Loaded: All; Pitch: 0.100" (2.54mm); Design Item Id: 5650478-5; Supplier 1: Digi-Key; Supplier Part Number 1: A32298-ND; Manufacturer Part Number: 5650478-5; RoHS: RoHS Compliant; Category: Connectors, Interconnects; Stock 1: 292; Pricing 1: 1=3.48, 25=3.17, 50=3.04, 100=2.95, 200=2.57, 500=2.26, 1000=2.10001, 2000=1.95001 (USD); Packaging: Bulk; Number of Rows: 3
U15 U16 = TROU_FIX: 2.7mm Mounting Hole for EasyPHI Eurocard; Design Item Id: TROU_FIX
U23 = RLP1-600-800: RIGHT ANGLE LIGHT PIPE, 2.8MM; Manufacturer: Bivar Inc.; Configuration: Single; Lens Style/Size: Round with Flat Top, 2.8mm; Design Item Id: RLP1-600-800; Supplier 1: Digi-Key; Supplier Part Number 1: 492-1454-ND; Manufacturer Part Number: RLP1-600-800; RoHS: RoHS Compliant; Category: Optoelectronics; Stock 1: 171; Pricing 1: 1=1.1, 10=0.852, 25=0.7944, 100=0.65, 250=0.54892, 500=0.52002, 1000=0.46224, 2500=0.3852 (USD); Type: Rigid; Mounting Type: Board Mount, Snap-In, Right Angle; ComponentLink1URL: http://www.bivar.com/portals/0/products/RLP1-XXX-XXX.pdf; ComponentLink1Description: http://www.bivar.com/portals/0/products/RLP1-XXX-XXX.pdf; Color: Clear
U51-U54 = CARD_BORDER: 159mm long 2mm wide strip for 160mm Eurocard Edge; Design Item Id: CARD_BORDER
Y1 = 7A-12.000MAAJ-T: CRYSTAL 12.0000MHZ 18PF SMD; Manufacturer: TXC CORPORATION; Frequency Stability: ±30ppm; ESR (Equivalent Series Resistance): 80 Ohm; Operating Mode: Fundamental; Design Item Id: 7A-12.000MAAJ-T; Supplier 1: Digi-Key; Supplier Part Number 1: 887-1081-1-ND; Manufacturer Part Number: 7A-12.000MAAJ-T; RoHS: RoHS Compliant; Category: Crystals and Oscillators; Stock 1: 22739; Pricing 1: 1=0.79, 10=0.658, 50=0.59, 100=0.525, 500=0.5 (USD); Packaging: Cut Tape (CT); Type: MHz Crystal; Operating Temperature: -20°C ~ 70°C; Mounting Type: Surface Mount; Package / Case: 2-SMD; ComponentLink1URL: http://www.txccrystal.com/images/pdf/7a.pdf; ComponentLink1Description: http://www.txccrystal.com/images/pdf/7a.pdf; Frequency: 12MHz; Frequency Tolerance: ±30ppm; Load Capacitance: 18pF; Ratings: -; Size / Dimension: 0.197" L x 0.126" W (5.00mm x 3.20mm); Height: 0.053" (1.35mm)